# EAGLE schematic Dual Motor Driver (EAGLE 6.5.0)
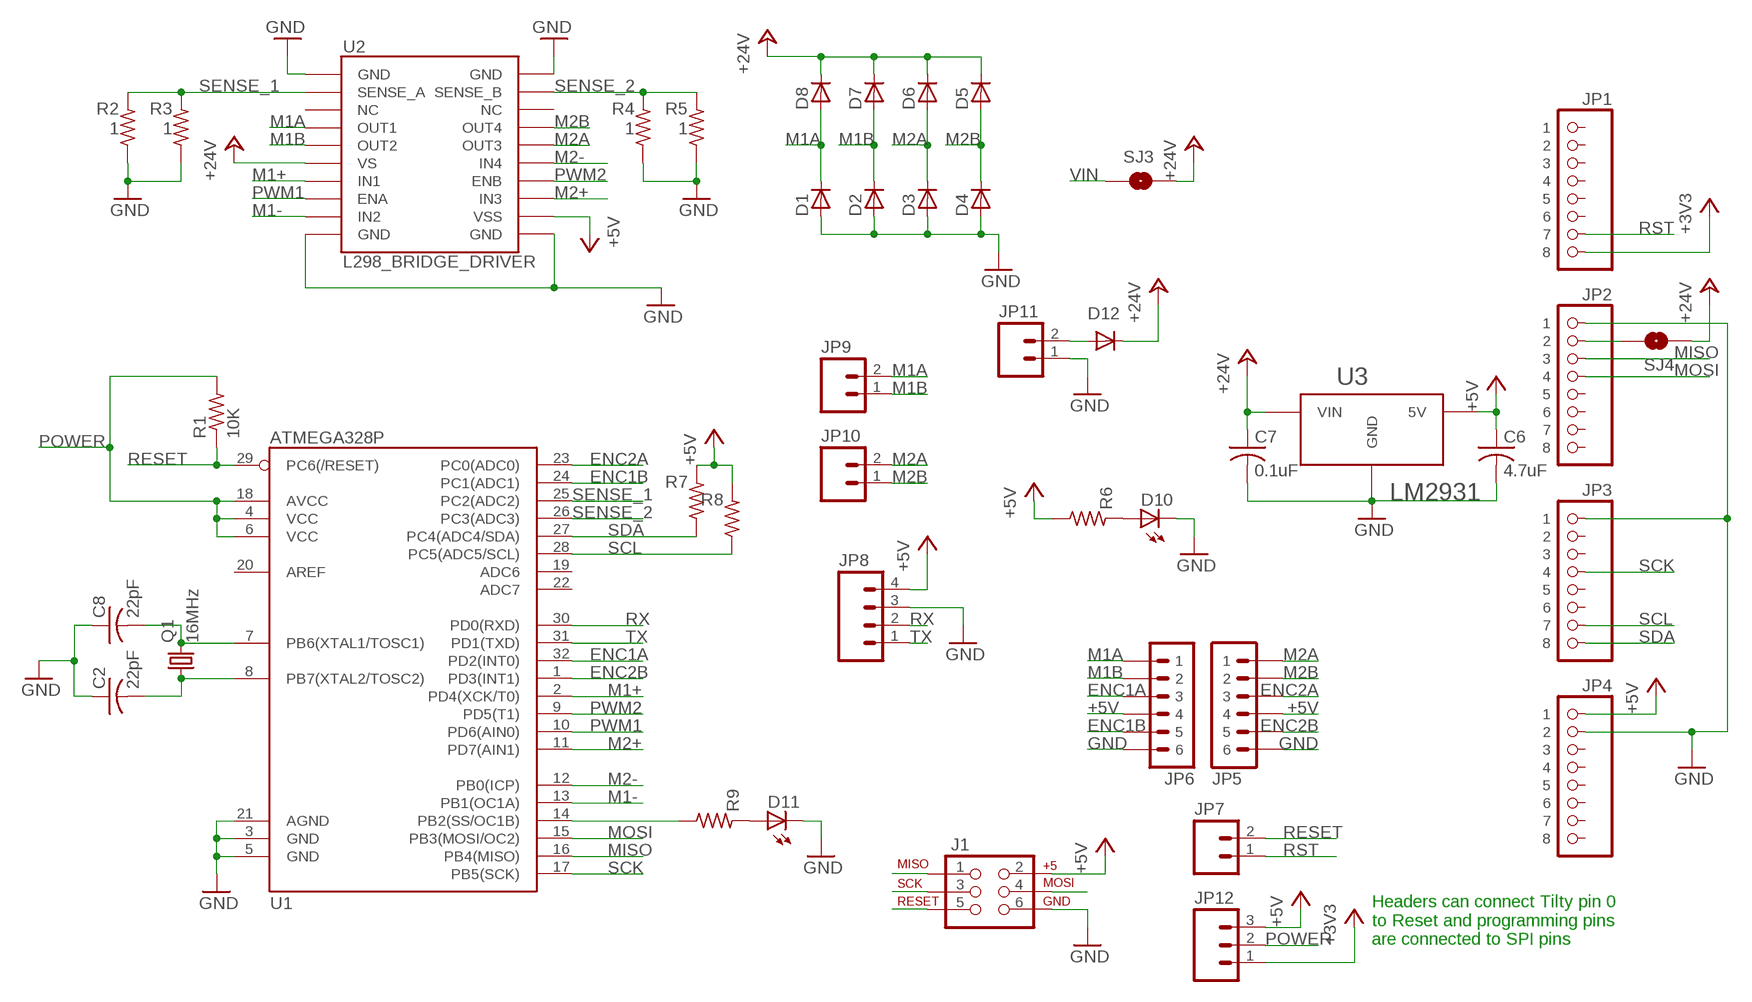
[diagram p0: schematic, sheet 1]

## Parts
C2  22pF  C-USC0603  [C0603]
C6  4.7uF  C-USC0603  [C0603]
C7  0.1uF  C-USC0603  [C0603]
C8  22pF  C-USC0603  [C0603]
D1  D-SOD123  [SOD123]
D2  D-SOD123  [SOD123]
D3  D-SOD123  [SOD123]
D4  D-SOD123  [SOD123]
D5  D-SOD123  [SOD123]
D6  D-SOD123  [SOD123]
D7  D-SOD123  [SOD123]
D8  D-SOD123  [SOD123]
D10  LED-GREENLED-0805_NO_SILK  [LED-0805]
D11  LED-GREENLED-0805_NO_SILK  [LED-0805]
D12  DIODESMB  [SMB-DIODE]
J1  AVR_SPI_PRG_62X3_LOCK  [2X3_LOCK]
JP1  8-PIN_HEADER  [8-PIN_RECEPTACLE_LOCK_NO-SS]
JP2  8-PIN_HEADER  [8-PIN_RECEPTACLE_LOCK_NO-SS]
JP3  8-PIN_HEADER  [8-PIN_RECEPTACLE_LOCK_NO-SS]
JP4  8-PIN_HEADER  [8-PIN_RECEPTACLE_LOCK_NO-SS]
JP5  6PIN-SH_RIGHT_ANGLE  [6PIN-SH_SERIES_RA]
JP6  6PIN-SH_RIGHT_ANGLE  [6PIN-SH_SERIES_RA]
JP7  M02PTH  [1X02]
JP8  M04PTH  [1X04]
JP9  M02PTH  [1X02]
JP10  M02PTH  [1X02]
JP11  M02PTH  [1X02]
JP12  M03PTH  [1X03]
Q1  16MHz  CRYSTALCTS406  [CTS406]
R1  10K  R-US_R0603  [R0603]
R2  1  R-US_R0603  [R0603]
R3  1  R-US_R0603  [R0603]
R4  1  R-US_R0603  [R0603]
R5  1  R-US_R0603  [R0603]
R6  R-US_R0603  [R0603]
R7  R-US_R0603  [R0603]
R8  R-US_R0603  [R0603]
R9  R-US_R0603  [R0603]
SJ3  SOLDERJUMPERNC  [SJ_2S]
SJ4  SOLDERJUMPERTRACE  [SJ_2S-TRACE]
U1  ATMEGA328P  ATMEGA328_SMT  [TQFP32-08]
U2  L298_BRIDGE_DRIVER  [POWERSO20]
U3  LM2931  [TO263]

## Nets
+3V3: JP1.P$8 JP12.1
+5V: C6.1 J1.2 JP4.P$1 JP5.P$4 JP6.P$4 JP8.4 JP12.3 R6.1 R7.2 R8.2 U2.12(VSS) U3.P$3(5V)
+24V: C7.1 D5.1(C) D6.1(C) D7.1(C) D8.1(C) D12.C SJ3.2 SJ4.1 U2.6(VS) U3.P$2(VIN)
ENC1A: JP6.P$3 U1.32(PD2(INT0))
ENC1B: JP6.P$5 U1.24(PC1(ADC1))
ENC2A: JP5.P$3 U1.23(PC0(ADC0))
ENC2B: JP5.P$5 U1.1(PD3(INT1))
GND: C2.1 C6.2 C7.2 C8.1 D1.2(A) D2.2(A) D3.2(A) D4.2(A) D10.2(C) D11.2(C) J1.6 JP2.P$1 JP3.P$1 JP4.P$2 JP5.P$6 JP6.P$6 JP8.3 JP11.1 R2.1 R3.1 R4.1 R5.1 U1.3(GND) U1.5(GND) U1.21(AGND) U2.1(GND) U2.10(GND) U2.11(GND) U2.20(GND) U3.P$1(GND)
M1+: U1.2(PD4(XCK/T0)) U2.7(IN1)
M1-: U1.13(PB1(OC1A)) U2.9(IN2)
M1A: D1.1(C) D8.2(A) JP6.P$1 JP9.2 U2.4(OUT1)
M1B: D2.1(C) D7.2(A) JP6.P$2 JP9.1 U2.5(OUT2)
M2+: U1.11(PD7(AIN1)) U2.13(IN3)
M2-: U1.12(PB0(ICP)) U2.15(IN4)
M2A: D3.1(C) D6.2(A) JP5.P$1 JP10.2 U2.16(OUT3)
M2B: D4.1(C) D5.2(A) JP5.P$2 JP10.1 U2.17(OUT4)
MISO: J1.1 JP2.P$3 U1.16(PB4(MISO))
MOSI: J1.4 JP2.P$4 U1.15(PB3(MOSI/OC2))
N$1: D10.1(A) R6.2
N$2: D11.1(A) R9.2
N$4: R9.1 U1.14(PB2(SS/OC1B))
N$5: JP2.P$2 SJ4.2
N$6: C8.2 Q1.3 U1.7(PB6(XTAL1/TOSC1))
N$7: C2.2 Q1.1 U1.8(PB7(XTAL2/TOSC2))
POWER: JP12.2 R1.2 U1.4(VCC) U1.6(VCC) U1.18(AVCC)
PWM1: U1.10(PD6(AIN0)) U2.8(ENA)
PWM2: U1.9(PD5(T1)) U2.14(ENB)
RESET: J1.5 JP7.2 R1.1 U1.29(PC6(/RESET))
RST: JP1.P$7 JP7.1
RX: JP8.2 U1.30(PD0(RXD))
SCK: J1.3 JP3.P$4 U1.17(PB5(SCK))
SCL: JP3.P$7 R8.1 U1.28(PC5(ADC5/SCL))
SDA: JP3.P$8 R7.1 U1.27(PC4(ADC4/SDA))
SENSE_1: R2.2 R3.2 U1.25(PC2(ADC2)) U2.2(SENSE_A)
SENSE_2: R4.2 R5.2 U1.26(PC3(ADC3)) U2.19(SENSE_B)
TX: JP8.1 U1.31(PD1(TXD))
VIN: D12.A JP11.2 SJ3.1
Unconnected: JP1.P$1 JP1.P$2 JP1.P$3 JP1.P$4 JP1.P$5 JP1.P$6 JP2.P$5 JP2.P$6 JP2.P$7 JP2.P$8 JP3.P$2 JP3.P$3 JP3.P$5 JP3.P$6 JP4.P$3 JP4.P$4 JP4.P$5 JP4.P$6 JP4.P$7 JP4.P$8 U1.19(ADC6) U1.20(AREF) U1.22(ADC7) U2.3(NC) U2.18(NC)

## Notes on the sheet
- Headers can connect Tilty pin 0
  to Reset and programming pins
  are connected to SPI pins

## Library data of the parts
C2 C6-C8 = resistor:C-US: CAPACITOR, American symbol
D1-D8 = semicon-smd-ipc:D-: DIODE unfilled; PART#: CDBW140-G
D10 D11 = SparkFun-LED:LED-GREEN: Various green LEDs 0603- DIO-00821 LARGE- DIO-00862 LILYPAD- DIO-09910
D12 = SparkFun-DiscreteSemi:DIODE: Diode These are standard reverse protection diodes and small signal diodes. SMA package can handle up to about 1A. SOD-323 can handle about 200mA. What the SOD-323 package when ordering, there are some mfgs out there that are 5-pin packages.
J1 = SparkFun-Connectors:AVR_SPI_PRG_6: AVR ISP 6 Pin This is the reduced ISP connector for AVR programming. Common on Arduino. This footprint will take up less PCB space and can be used with a 10-pin to 6-pin adapter such as SKU: BOB-08508
JP1-JP4 = My Parts:8-PIN_HEADER
JP5 JP6 = con-jst:6PIN-SH; PART#: SM06B-SRSS-TB(LF)(SN)
JP7 JP9-JP11 = SparkFun-Connectors:M02: Header 2 Standard 2-pin 0.1" header. Use with straight break away headers (SKU : PRT-00116), right angle break away headers (PRT-00553), swiss pins (PRT-00743), machine pins (PRT-00117), and female headers (PRT-00115). Molex polarized connector foot print use with SKU : PRT-08233 with associated crimp pins and housings.
JP8 = SparkFun-Connectors:M04: Header 4 Standard 4-pin 0.1" header. Use with straight break away headers (SKU : PRT-00116), right angle break away headers (PRT-00553), swiss pins (PRT-00743), machine pins (PRT-00117), and female headers (PRT-00115). Molex polarized connector foot print use with SKU : PRT-08231 with associated crimp pins and housings. 1MM SMD Version SKU: PRT-10208
JP12 = SparkFun-Connectors:M03: Header 3 Standard 3-pin 0.1" header. Use with straight break away headers (SKU : PRT-00116), right angle break away headers (PRT-00553), swiss pins (PRT-00743), machine pins (PRT-00117), and female headers (PRT-00115). Molex polarized connector foot print use with SKU : PRT-08232 with associated crimp pins and housings.
Q1 = crystal:CRYSTAL: CRYSTAL; OC_FARNELL: unknown; OC_NEWARK: unknown; PART#: 406C35D16M00000
R1-R9 = resistor:R-US_: RESISTOR, American symbol
SJ3 SJ4 = SparkFun-Passives:SOLDERJUMPER: Solder Jumper Standard SMD solder jumper. Used to automate production. Two varients : Normally Open and Normally Closed are the same, but have different paste layers. NC will have a large amount of paste and should jumper during reflow.
U1 = SparkFun-DigitalIC:ATMEGA328_SMT: 32-Pin Atmega328 part Commonly used on Arduino compatible boards Available in QFP and QFN packages TQFP is IC-09069 QFN is non-stock; PROD_ID: IC-09069
U2 = SparkFun-PowerIC:L298_BRIDGE_DRIVER: Full-bridge power driver IC
U3 = on-semiconductor:LM2931